# EasyEDA Pro project ProPrj_Compact_LED_Driver_PWM_Single_ATtiny1616_Double_2024-10-07.epro, schematic schematic1
Board Name: Board1; Create Date: 2024-02-08; Project Name: Compact_LED_Driver_PWM_Single_ATtiny1616_Double; Schematic Name: schematic1; Update Date: 2024-02-11
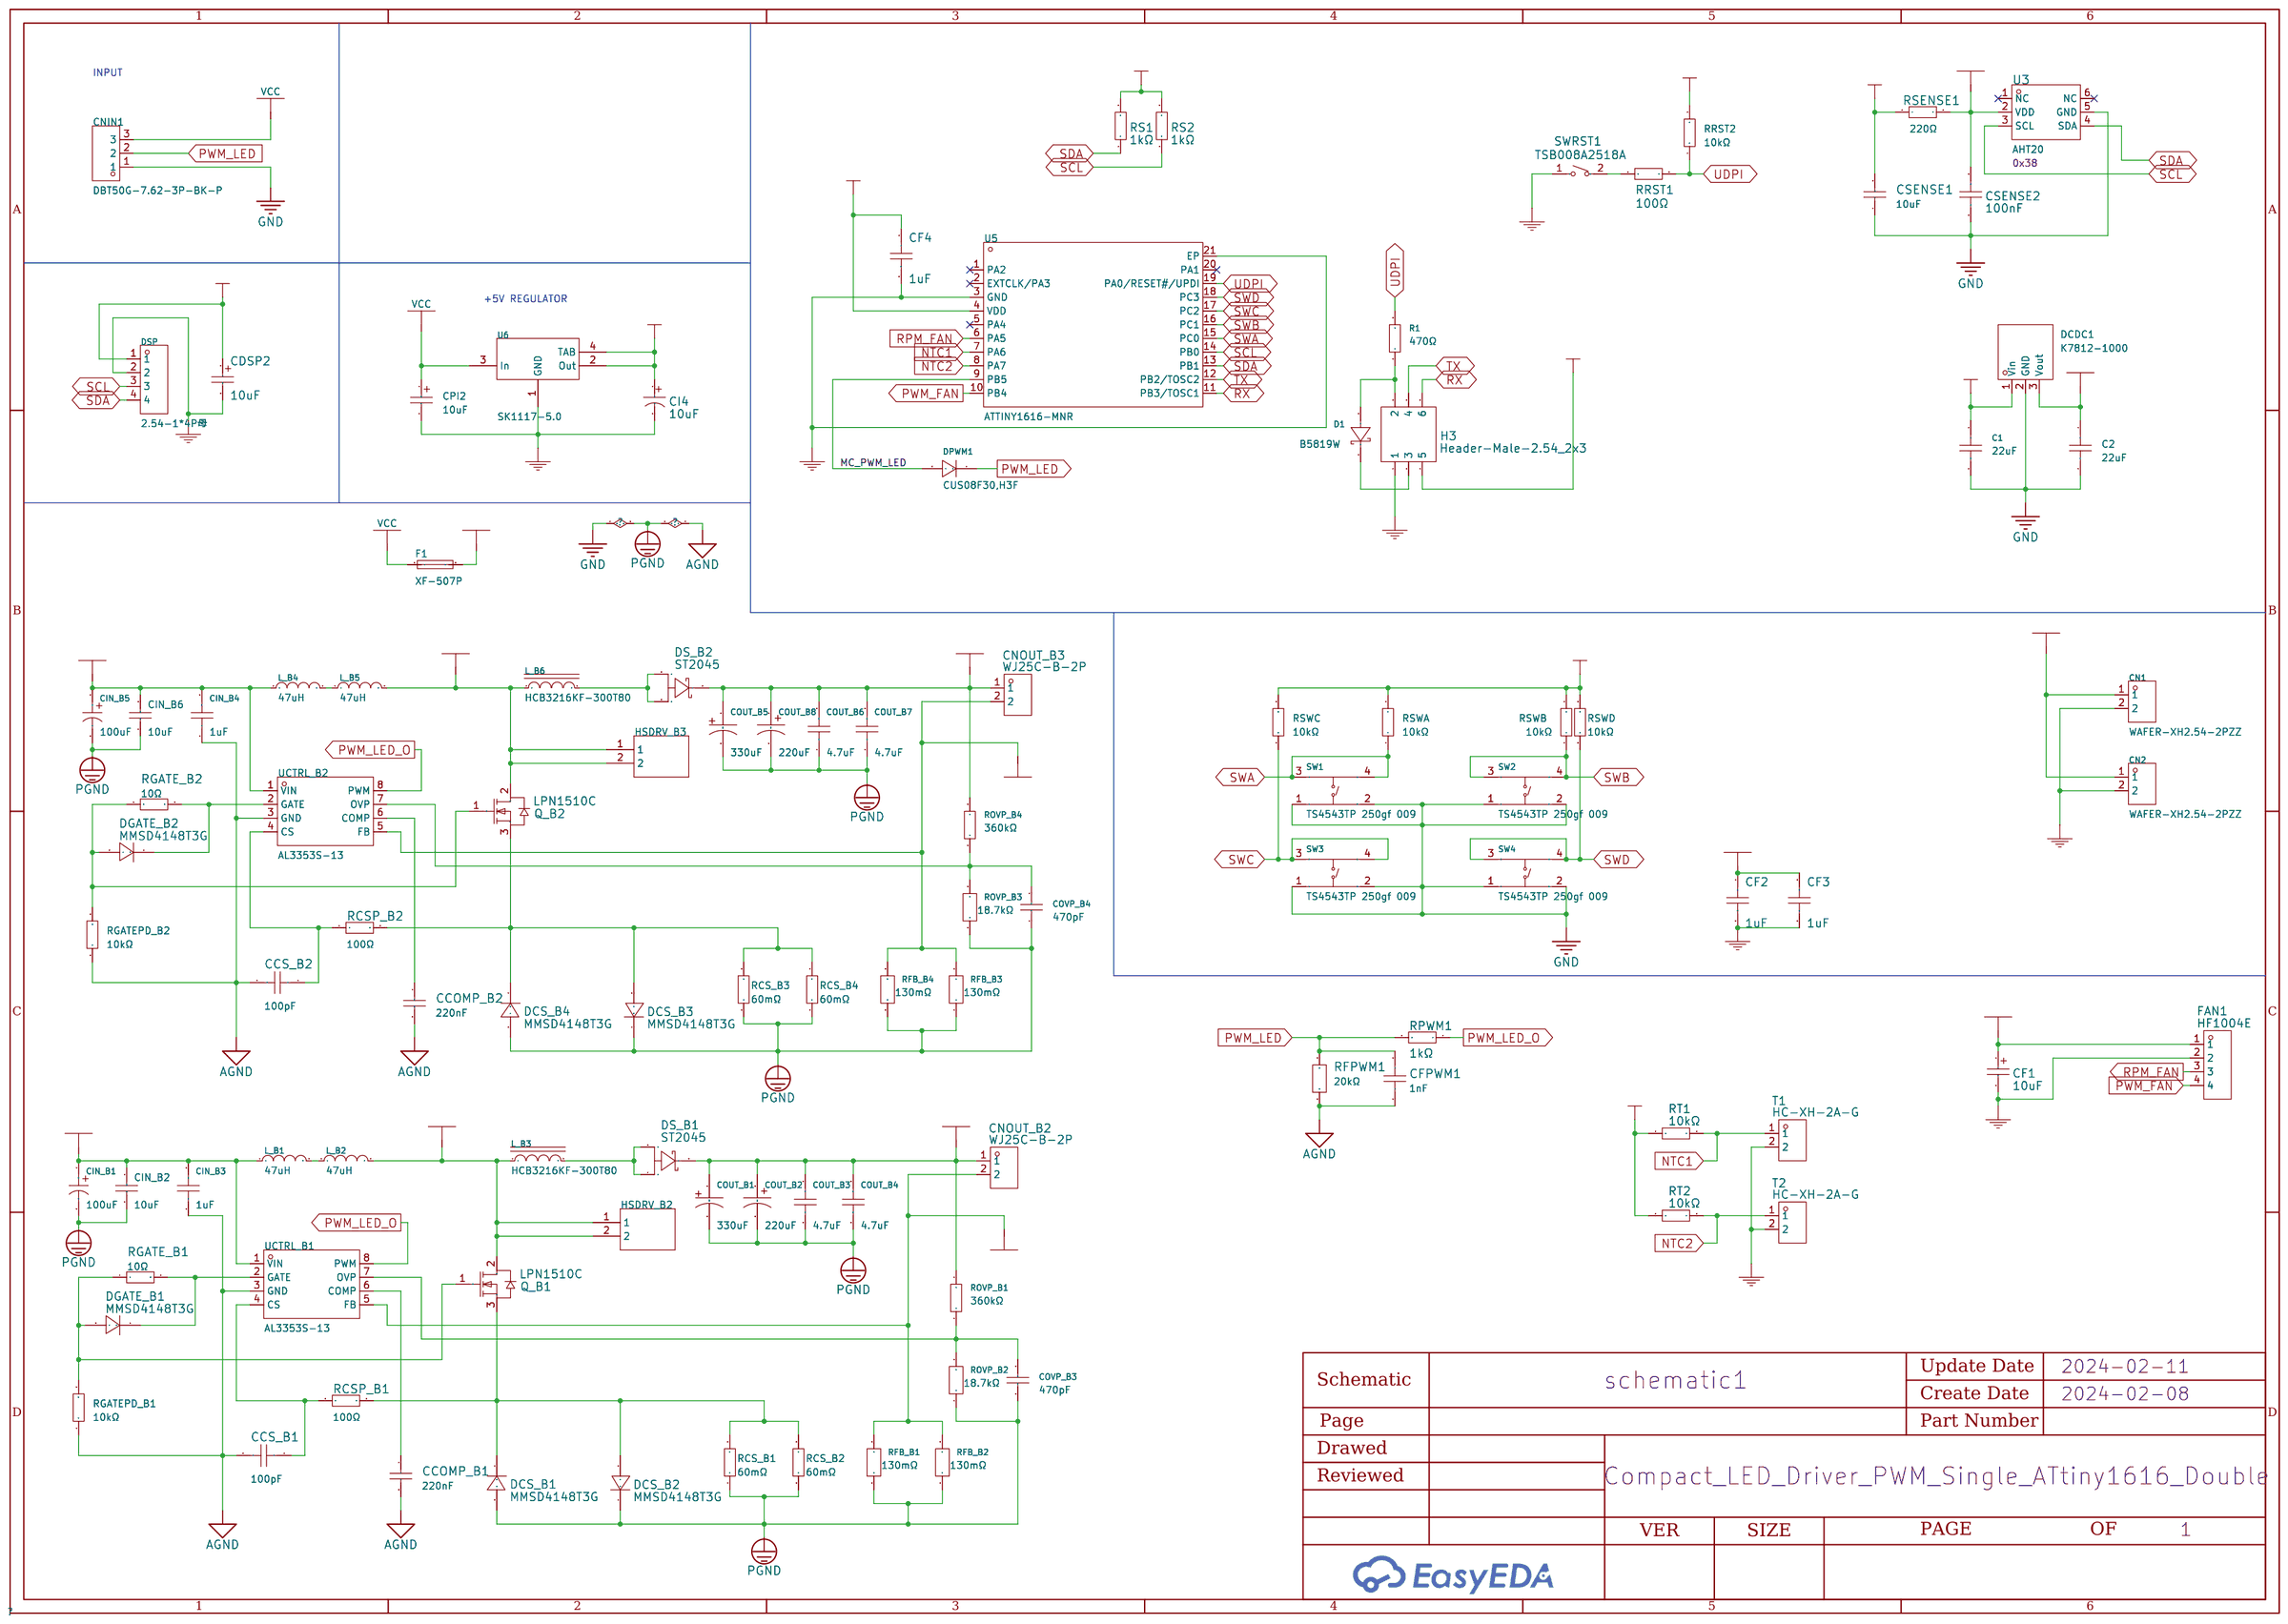
[diagram p0: schematic sheet]

## Parts
C1  22uF  [C0805]
C2  22uF  [C0805]
CCOMP_B1  220nF  [C0402]
CCOMP_B2  220nF  [C0402]
CCS_B1  100pF  [C0402]
CCS_B2  100pF  [C0402]
CDSP2  10uF  [CAP-SMD_L3.2-W1.6-R-RD]
CF1  10uF  [CAP-SMD_L3.5-W2.8]
CF2  1uF  [0402]
CF3  1uF  [0402]
CF4  1uF  [0402]
CFPWM1  1nF  [C0603]
CI4  10uF  [CAP-SMD_L3.2-W1.6]
CIN_B1  100uF  [CAP-TH_BD10.0-P5.00-D0.6-FD-A]
CIN_B2  10uF  [C0805]
CIN_B3  1uF  [C0402]
CIN_B4  1uF  [C0402]
CIN_B5  100uF  [CAP-TH_BD10.0-P5.00-D0.6-FD-A]
CIN_B6  10uF  [C0805]
CN1  WAFER-XH2.54-2PZZ  [CONN-TH_XH2.54-2P]
CN2  WAFER-XH2.54-2PZZ  [CONN-TH_XH2.54-2P]
CNIN1  DBT50G-7.62-3P-BK-P  [CONN-TH_3P-P7.62_L15.2-W24.4-EX4.2]
CNOUT_B2  WJ25C-B-2P  [CONN-TH_2P-P7.62_WJ25C-B-7.62-2P]
CNOUT_B3  WJ25C-B-2P  [CONN-TH_2P-P7.62_WJ25C-B-7.62-2P]
COUT_B1  330uF  [CAP-TH_BD10.0-P5.00-D1.0-FD]
COUT_B2  220uF  [CAP-TH_BD10.0-P5.00-D0.6-FD-A]
COUT_B3  4.7uF  [C1210]
COUT_B4  4.7uF  [C1210]
COUT_B5  330uF  [CAP-TH_BD10.0-P5.00-D1.0-FD]
COUT_B6  4.7uF  [C1210]
COUT_B7  4.7uF  [C1210]
COUT_B8  220uF  [CAP-TH_BD10.0-P5.00-D0.6-FD-A]
COVP_B3  470pF  [C0402]
COVP_B4  470pF  [C0402]
CPI2  10uF  [CASE-C_6032]
CSENSE1  10uF  [C0402]
CSENSE2  100nF  [C0402]
D1  B5819W  [SOD-123F_L2.7-W1.6-LS3.8-RD-1]
DCDC1  K7812-1000  [PWRM-TH_K78XX-1000]
DCS_B1  MMSD4148T3G  [SOD-123FL_L2.6-W1.6-LS3.4-RD]
DCS_B2  MMSD4148T3G  [SOD-123FL_L2.6-W1.6-LS3.4-RD]
DCS_B3  MMSD4148T3G  [SOD-123FL_L2.6-W1.6-LS3.4-RD]
DCS_B4  MMSD4148T3G  [SOD-123FL_L2.6-W1.6-LS3.4-RD]
DGATE_B1  MMSD4148T3G  [SOD-123FL_L2.6-W1.6-LS3.4-RD]
DGATE_B2  MMSD4148T3G  [SOD-123FL_L2.6-W1.6-LS3.4-RD]
DPWM1  CUS08F30,H3F  [SOD-323F_L2.0-W1.6-LS2.5-RD]
DS_B1  ST2045  [TO-277_3P-L5.4-W4.0-LS6.5-BR]
DS_B2  ST2045  [TO-277_3P-L5.4-W4.0-LS6.5-BR]
DSP  2.54-1*4P母  [HDR-TH_4P-P2.54-V-F]
F1  XF-507P  [CONN-TH_XF-507P]
FAN1  HF1004E  [CONN-TH_4P-P2.54_HF1004E]
H3  Header-Male-2.54_2x3  [HDR-TH_6P-P2.54-V-M-R2-C3-S2.54-1]
HSDRV_B2  -  [xsd366094]
HSDRV_B3  -  [xsd366094]
L_B1  47uH  [IND-TH_L17.8-W17.8-P13.00-D0.6]
L_B2  47uH  [IND-TH_L17.8-W17.8-P13.00-D0.6]
L_B3  HCB3216KF-300T80  [L1206]
L_B4  47uH  [IND-TH_L17.8-W17.8-P13.00-D0.6]
L_B5  47uH  [IND-TH_L17.8-W17.8-P13.00-D0.6]
L_B6  HCB3216KF-300T80  [L1206]
Q_B1  LPN1510C  [TO-220-3_L10.0-W4.5-P2.54-L]
Q_B2  LPN1510C  [TO-220-3_L10.0-W4.5-P2.54-L]
R1  470Ω  [R0402]
RCS_B1  60mΩ  [R2512]
RCS_B2  60mΩ  [R2512]
RCS_B3  60mΩ  [R2512]
RCS_B4  60mΩ  [R2512]
RCSP_B1  100Ω  [R0402]
RCSP_B2  100Ω  [R0402]
RFB_B1  130mΩ  [RES-SMD_L6.4-W3.2-R2512]
RFB_B2  130mΩ  [RES-SMD_L6.4-W3.2-R2512]
RFB_B3  130mΩ  [RES-SMD_L6.4-W3.2-R2512]
RFB_B4  130mΩ  [RES-SMD_L6.4-W3.2-R2512]
RFPWM1  20kΩ  [R0402]
RGATE_B1  10Ω  [R0402]
RGATE_B2  10Ω  [R0402]
RGATEPD_B1  10kΩ  [R0402]
RGATEPD_B2  10kΩ  [R0402]
ROVP_B1  360kΩ  [R0402]
ROVP_B2  18.7kΩ  [R0402]
ROVP_B3  18.7kΩ  [R0402]
ROVP_B4  360kΩ  [R0402]
RPWM1  1kΩ  [R0402]
RRST1  100Ω  [R0402]
RRST2  10kΩ  [R0402]
RS1  1kΩ  [R0402]
RS2  1kΩ  [R0402]
RSENSE1  220Ω  [R0402]
RSWA  10kΩ  [R0402]
RSWB  10kΩ  [R0402]
RSWC  10kΩ  [R0402]
RSWD  10kΩ  [R0402]
RT1  10kΩ  [R0402]
RT2  10kΩ  [R0402]
SW1  TS4543TP 250gf 009  [SW-SMD_4P-L4.5-W4.5-P3.00-LS6.9]
SW2  TS4543TP 250gf 009  [SW-SMD_4P-L4.5-W4.5-P3.00-LS6.9]
SW3  TS4543TP 250gf 009  [SW-SMD_4P-L4.5-W4.5-P3.00-LS6.9]
SW4  TS4543TP 250gf 009  [SW-SMD_4P-L4.5-W4.5-P3.00-LS6.9]
SWRST1  TSB008A2518A  [SW-SMD_L6.0-W3.5-LS8.2]
T1  HC-XH-2A-G  [CONN-TH_2P-P2.50_HC-XH-2A-G]
T2  HC-XH-2A-G  [CONN-TH_2P-P2.50_HC-XH-2A-G]
U3  AHT20  [SENSOR-SMD_L3.0-W3.0-P1.00-BR]
U5  ATTINY1616-MNR  [QFN-20_L3.0-W3.0-P0.40-BL-EP1.7]
U6  SK1117-5.0  [SOT-223_L6.5-W3.5-P2.30-LS7.0-BR]
UCTRL_B1  AL3353S-13  [SOIC-8_L4.9-W3.9-P1.27-LS6.0-BL]
UCTRL_B2  AL3353S-13  [SOIC-8_L4.9-W3.9-P1.27-LS6.0-BL]

## Library data of the parts
C1 = CGA0805X5R226M350MT: Capacitance:22uF Tolerance:±20% Tolerance:±20% Voltage Rated: Temperature Coefficient:; LCSC Part Name: 22uF ±20% 35V; Supplier Part: C6119901; Manufacturer: HRE(芯声); Supplier Footprint: 0805; JLCPCB Part Class: Extended Part; Datasheet: https://atta.szlcsc.com/upload/public/pdf/source/20231129/D589D0CC4D260F7AC3A77E53B455CCB3.pdf; Supplier: LCSC; Tolerance: ±20%
C2 = CL21A226MAYNNNE: Capacitance: Tolerance:±20% Tolerance:±20% Voltage Rated: Temperature Coefficient:; LCSC Part Name: 22uF ±20% 25V; Supplier Part: C602037; Manufacturer: SAMSUNG(三星); Supplier Footprint: 0805; JLCPCB Part Class: Extended Part; Datasheet: https://atta.szlcsc.com/upload/public/pdf/source/20200609/C602037_1A0D619693E608A1BF6E80154254E2DB.pdf; Supplier: LCSC; Tolerance: ±20%
CCOMP_B1 CCOMP_B2 = CL05A224KA5NNNC: Capacitance: Tolerance:±10% Tolerance:±10% Voltage Rated: Temperature Coefficient:; LCSC Part Name: 220nF ±10% 25V; Supplier Part: C47129; Manufacturer: SAMSUNG(三星); Supplier Footprint: 0402; JLCPCB Part Class: Extended Part; Datasheet: https://atta.szlcsc.com/upload/public/pdf/source/20160218/1457707763339.pdf; Supplier: LCSC; Tolerance: ±10%
CCS_B1 CCS_B2 = TCC0402COG101K500AT: Capacitance: Tolerance:±10% Tolerance:±10% Voltage Rated: Temperature Coefficient:; LCSC Part Name: 100pF ±10% 50V; Supplier Part: C696853; Manufacturer: CCTC(三环); Supplier Footprint: 0402; JLCPCB Part Class: Extended Part; Datasheet: https://atta.szlcsc.com/upload/public/pdf/source/20200707/C696841_89A2C111301AB76AE7642008585E7A11.pdf; Supplier: LCSC; Tolerance: ±10%
CDSP2 = 10uF: Supplier: LCSC; Manufacturer: AVX; Manufacturer Part: TAJA106K010RNJ; Supplier Part: C7177; JLCPCB Part Class: Extend
CF1 = 10uF: Supplier: LCSC; Manufacturer: Xiangyee; Manufacturer Part: CA45-B025K106T; Supplier Part: C119050; JLCPCB Part Class: Extend
CF2-CF4 = 1uF: Supplier: LCSC; Manufacturer: SAMSUNG; Manufacturer Part: CL05A105KA5NQNC; Supplier Part: C52923; JLCPCB Part Class: Basic
CFPWM1 = FN18X102K500PSG: Capacitance: Tolerance:±10% Tolerance:±10% Voltage Rated: Temperature Coefficient:; LCSC Part Name: 1nF ±10% 50V; Supplier Part: C525263; Manufacturer: PSA(信昌电陶); Supplier Footprint: 0603; JLCPCB Part Class: Extended Part; Datasheet: https://atta.szlcsc.com/upload/public/pdf/source/20200506/C436246_4EAA78C9048D88437BAF2CB7B8BE45FD.pdf; Supplier: LCSC; Tolerance: ±10%
CI4 = 10uF: Supplier: LCSC; Manufacturer: Xiangyee; Manufacturer Part: CA45-A016K106T; Supplier Part: C119051; JLCPCB Part Class: Extend
CIN_B1 CIN_B5 = 1010631012R00: Capacitance: Tolerance:±20% Tolerance:±20% Rated Voltage: φD: L: Operating Temperature:-55℃~+105℃ Operating Temperature:-55℃~+105℃; LCSC Part Name: 100uF ±20% 63V; Supplier Part: C2887235; Manufacturer: NJCON(永立); Supplier Footprint: 插件,D10xL12mm; JLCPCB Part Class: Extended Part; Datasheet: https://atta.szlcsc.com/upload/public/pdf/source/20210902/84CE7E45D44660992A8A41ADB32108B0.pdf; Supplier: LCSC; Tolerance: ±20%; Operating Temperature: -55℃~+105℃
CIN_B2 CIN_B6 = CL21A106KAYNNNE_C15850: Capacitance: Tolerance:±10% Tolerance:±10% Voltage Rated: Temperature Coefficient:; LCSC Part Name: 10uF ±10% 25V; Supplier Part: C15850; Manufacturer: SAMSUNG(三星); Manufacturer Part: CL21A106KAYNNNE; Supplier Footprint: 0805; JLCPCB Part Class: Basic Part; Datasheet: https://atta.szlcsc.com/upload/public/pdf/source/20160103/1457707679302.pdf; Supplier: LCSC; Tolerance: ±10%
CIN_B3 CIN_B4 = CL05A105KA5NQNC: Capacitance: Tolerance:±10% Tolerance:±10% Voltage Rated: Temperature Coefficient:; LCSC Part Name: 1uF ±10% 25V; Supplier Part: C52923; Manufacturer: SAMSUNG(三星); Supplier Footprint: 0402; JLCPCB Part Class: Basic Part; Datasheet: https://atta.szlcsc.com/upload/public/pdf/source/20160218/1457707763339.pdf; Supplier: LCSC; Tolerance: ±10%
CN1 CN2 = WAFER-XH2.54-2PZZ: Pins Structure:1x2P Pitch:2.54mm Mounting Style:Straight Number of Pins:2P Number of Rows:1 Number of PINs Per Row:2 Current Rating (Max):2A Operating Temperature Range:-25℃~+85℃ Operating Temperature Range:-25℃~+85℃; LCSC Part Name: XH 2.54mm 1x2P 直插; Supplier Part: C5359631; Manufacturer: XUNPU(讯普); Supplier Footprint: 插件,P=2.54mm; JLCPCB Part Class: Extended Part; Datasheet: https://atta.szlcsc.com/upload/public/pdf/source/20230221/5D6483F9C7001DB87CFCFC787E1DC139.pdf; Supplier: LCSC; Pins Structure: 1x2P; Pitch: 2.54mm; Mounting Style: Straight; Number of Pins: 2P; Number of Rows: 1; Number of PINs Per Row: 2; Current Rating (Max): 2A; Operating Temperature Range: -25℃~+85℃
CNIN1 = DBT50G-7.62-3P-BK-P: Barrier Type:带盖板 Pitch:7.62mm Number of PINs Per Row:3 Number of Rows:1 Mounting Style:直针 Pin Location:边脚 Current Rating (Max):20A Voltage Rating (Max):300V Wire Gauge - AWG:12~22 Wire Gauge - mm?:- Operating Temperature Range:-40℃~+105℃ Operating Tempera; LCSC Part Name: 7.62mm 每排P数:3 排数:1 直针 边脚; Supplier Part: C496128; Manufacturer: DIBO(地博电气); Supplier Footprint: 直插,P=7.62mm; JLCPCB Part Class: Extended Part; Datasheet: https://atta.szlcsc.com/upload/public/pdf/source/20200325/C496127_C06BD9E7CF9E9F2FA4FD569ADCB4ABF1.pdf; Supplier: LCSC; Barrier Type: 带盖板; Pitch: 7.62mm; Number of PINs Per Row: 3; Number of Rows: 1; Mounting Style: 直针; Pin Location: 边脚; Current Rating (Max): 20A; Voltage Rating (Max): 300V; Wire Gauge - AWG: 12~22; Operating Temperature Range: -40℃~+105℃; Color: Black
CNOUT_B2 CNOUT_B3 = WJ25C-B-2P: Supplier: LCSC; Manufacturer: KANGNEX(康奈克斯电气); Manufacturer Part: WJ25C-B-7.62-2P; Supplier Part: C8422; JLCPCB Part Class: Extended Part; link: https://lcsc.com/eda_search?q=C8422&amp;%26type=1&amp;ref=editor
COUT_B1 COUT_B5 = RG063M331LO10*20TA-1A1E: Capacitance: Tolerance:±20% Tolerance:±20% Rated Voltage: Lead Spacing: φD: L: Lifetime @ Temp:7000hrs@105℃; LCSC Part Name: 330uF ±20% 63V; Supplier Part: C357629; Manufacturer: BERYL(绿宝石); Supplier Footprint: 插件,D10xL20mm; JLCPCB Part Class: Extended Part; Datasheet: https://atta.szlcsc.com/upload/public/pdf/source/20190116/C365798_BC4DCA200151769C852491AB8CDBB435.pdf; Supplier: LCSC; Tolerance: ±20%; Lifetime @ Temp: 7000hrs@105℃
COUT_B2 COUT_B8 = SPZ1JM221G15O00RAXXX: Capacitance: Tolerance:±20% Tolerance:±20% Rated Voltage: Ripple Current:2.65A@100kHz Equivalent Series Resistance(ESR):20mΩ@100kHz Type:Polymer Lead Spacing: φD: L: Lifetime @ Temp:2000hrs@105℃ Operating Temperature:-55℃~+105℃ Operating Temperature:-55℃~; LCSC Part Name: 220uF ±20% 63V; Supplier Part: C2983797; Manufacturer: AISHI(艾华集团); Supplier Footprint: 插件,D10xL15mm; JLCPCB Part Class: Extended Part; Datasheet: https://atta.szlcsc.com/upload/public/pdf/source/20180906/C160181_A9A2ACDA3CC278FCDBAF747E681A6DA5.pdf; Supplier: LCSC; Tolerance: ±20%; Ripple Current: 2.65A@100kHz; Equivalent Series Resistance(ESR): 20mΩ@100kHz; Type: Polymer; Lifetime @ Temp: 2000hrs@105℃; Operating Temperature: -55℃~+105℃
COUT_B3 COUT_B4 COUT_B6 COUT_B7 = FS32X475K101EGG: Capacitance: Tolerance:±10% Tolerance:±10% Voltage Rated: Temperature Coefficient:; LCSC Part Name: 4.7uF ±10% 100V; Supplier Part: C381466; Manufacturer: PSA(信昌电陶); Supplier Footprint: 1210; JLCPCB Part Class: Extended Part; Datasheet: https://atta.szlcsc.com/upload/public/pdf/source/20190723/C381466_B1CCDB289216E7EE775C98769E222CFD.pdf; Supplier: LCSC; Tolerance: ±10%
COVP_B3 COVP_B4 = 0402B471K500NT: Capacitance: Tolerance:±10% Tolerance:±10% Voltage Rated: Temperature Coefficient:; LCSC Part Name: 470pF ±10% 50V; Supplier Part: C1537; Manufacturer: FH(风华); Supplier Footprint: 0402; JLCPCB Part Class: Basic Part; Datasheet: https://atta.szlcsc.com/upload/public/pdf/source/20200305/C486355_26A10D38EF8C2A5C37091D0039909270.pdf; Supplier: LCSC; Tolerance: ±10%
CPI2 = TAJC106K035RNJ: Capacitance: Tolerance:±10% Tolerance:±10% Rated Voltage: Equivalent Series Resistance(ESR):1.6Ω@100kHz Operating Temperature:-55℃~+125℃ Operating Temperature:-55℃~+125℃; LCSC Part Name: 10uF ±10% 35V; Supplier Part: C7211; Manufacturer: Kyocera AVX; Supplier Footprint: CASE-C-6032; JLCPCB Part Class: Extended Part; Datasheet: https://atta.szlcsc.com/upload/public/pdf/source/20160107/1457707750344.pdf; Supplier: LCSC; Tolerance: ±10%; Equivalent Series Resistance(ESR): 1.6Ω@100kHz; Operating Temperature: -55℃~+125℃
CSENSE1 = CL05A106MQ5NUNC: Capacitance: Tolerance:±20% Tolerance:±20% Voltage Rated: Temperature Coefficient:; LCSC Part Name: 10uF ±20% 6.3V; Supplier Part: C15525; Manufacturer: SAMSUNG(三星); Supplier Footprint: 0402; JLCPCB Part Class: Basic Part; Datasheet: https://atta.szlcsc.com/upload/public/pdf/source/20220823/2B02EE04F8F211D38A52DCB16EB6BEBA.pdf; Supplier: LCSC; Tolerance: ±20%
CSENSE2 = 100nF: Supplier: LCSC; Supplier Part: C392963; Manufacturer: CCTC(三环); Manufacturer Part: TCC0402X7R104K160AT; JLCPCB Part Class: Extended Part; link: https://lcsc.com/eda_search?q=C392963&amp;%26type=1&amp;ref=editor
D1 = B5819W_C2943878: Diode Configuration:- Forward Voltage (Vf@If):580mV@1A Reverse Voltage (Vr):40V Average Rectified Current (Io):1A Reverse Leakage Current (Ir):50uA@40V; LCSC Part Name: 电压:40V 电流:1A; Supplier Part: C2943878; Manufacturer: GOODWORK(固得沃克); Supplier Footprint: SOD-123; JLCPCB Part Class: Extended Part; Datasheet: https://atta.szlcsc.com/upload/public/pdf/source/20220114/81042131F39C8520B6390246D7392C1A.pdf; Supplier: LCSC; Forward Voltage (Vf@If): 580mV@1A; Reverse Voltage (Vr): 40V; Average Rectified Current (Io): 1A; Reverse Leakage Current (Ir): 50uA@40V
DCDC1 = K7812-1000_C5199013: Conversion Type:DC-DC Input Voltage(DC):16V~30V Input Voltage(DC):16V~30V Output Voltage:12V；-12V Output Voltage:12V；-12V Output Power:12W Output Current (Max):1A Output Current (Max):1A Function:降压型 Conversion Efficiency:93% Conversion Efficiency:93% Max; Supplier Part: C5199013; Manufacturer: JETEKPS(健特); Supplier Footprint: SIP-3; JLCPCB Part Class: Extended Part; Datasheet: https://atta.szlcsc.com/upload/public/pdf/source/20221014/D9FCF1D4FFB50CA154AEC6EC404A5A87.pdf; Supplier: LCSC; Conversion Type: DC-DC; Input Voltage(DC): 16V~30V; Output Voltage: 12V；-12V; Output Power: 12W; Output Current (Max): 1A; Function: 降压型; Conversion Efficiency: 93%; Maximum Capacitive Load: 680uF
DCS_B1-DCS_B4 DGATE_B1 DGATE_B2 = MMSD4148T3G: Supplier: LCSC; Supplier Part: C232560; Manufacturer: ONSemicon
DPWM1 = CUS08F30,H3F: Forward Voltage (Vf@If):220mV@10mA Reverse Voltage (Vr):30V Average Rectified Current (Io):800mA Reverse Leakage Current (Ir):50uA@30V; LCSC Part Name: 电压:30V 电流:800mA; Supplier Part: C150183; Manufacturer: TOSHIBA(东芝); Supplier Footprint: SC-76(SOD-323); JLCPCB Part Class: Extended Part; Datasheet: https://atta.szlcsc.com/upload/public/pdf/source/20180126/C150183_15169561730551309331.pdf; Supplier: LCSC; Forward Voltage (Vf@If): 220mV@10mA; Reverse Voltage (Vr): 30V; Average Rectified Current (Io): 800mA; Reverse Leakage Current (Ir): 50uA@30V
DS_B1 DS_B2 = ST2045: Supplier: LCSC; Supplier Part: C840773; Manufacturer: MDD（MicrodiodeElectronics）; JLCPCB Part Class: ExtendedPart
DSP = 2.54-1*4P母: Number of Rows:Plugin Number of Holes:4P Pitch:2.54mm Holes Structure:1x4P Row Spacing:- Mounting Type:Straight Circular Hole / Square Hole:Square Holes Current Rating (Max):3A Voltage Rating (Max):- Holes Direction:Top Insulation Height:- Contact Materia; LCSC Part Name: 间距:2.54mm 1x4P 直插; Supplier Part: C2718488; Manufacturer: BOOMELE(博穆精密); Supplier Footprint: 插件,P=2.54mm; JLCPCB Part Class: Extended Part; Datasheet: https://atta.szlcsc.com/upload/public/pdf/source/20210301/C2718488_F4427B881E42CAA8DDB0B1C12B3A522C.pdf; Supplier: LCSC; Number of Rows: Plugin; Number of Holes: 4P; Pitch: 2.54mm; Holes Structure: 1x4P; Mounting Type: Straight; Circular Hole / Square Hole: Square Holes; Current Rating (Max): 3A; Holes Direction: Top; Contact Material: bronze; Operating Temperature Range: -40℃~+105℃
F1 = XF-507P: Fuseholder Type:- Fuse Type:- Fuse Size:-; LCSC Part Name: 中号汽车保险丝夹 2P; Supplier Part: C668119; Manufacturer: XFCN(兴飞); JLCPCB Part Class: Extended Part; Datasheet: https://atta.szlcsc.com/upload/public/pdf/source/20210825/7557D7920E5607B38A356D661AFA8BB4.pdf; Supplier: LCSC
FAN1 = HF1004E: JLCPCB Part Class: Extended Part; Supplier: LCSC; Supplier Part: C2761402; Manufacturer: FOXCONN(富士康); link: https://lcsc.com/eda_search?q=C2761402&amp;%26type=1&amp;ref=editor
H3 = Header-Male-2.54_2x3: Supplier: LCSC; Manufacturer: BOOMELE; Supplier Part: C65114
HSDRV_B2 HSDRV_B3 = XSD366-094: Supplier: LCSC; Part Number: C286227; Manufacturer: XSD
L_B1 L_B2 L_B4 L_B5 = PDPMAA1712-470MP: Inductance: Tolerance:±20% Tolerance:±20% Rated Current: Type:- DC Resistance (DCR): Saturation Current (Isat):14A Ratings:AEC-Q200; LCSC Part Name: 47uH ±20% 14A; Supplier Part: C5119635; Manufacturer: PROD(谱罗德); Supplier Footprint: 插件,12x17mm; JLCPCB Part Class: Extended Part; Datasheet: https://atta.szlcsc.com/upload/public/pdf/source/20220726/50FFBD826C58D9A93824C56B87EB4C0A.pdf; Supplier: LCSC; Tolerance: ±20%; Saturation Current (Isat): 14A; Ratings: AEC-Q200
L_B3 L_B6 = HCB3216KF-300T80: Impedance @ Frequency:30Ω@100MHz Tolerance:±25% Tolerance:±25% DC Resistance:10mΩ Current Rating:8A Circuits:1; LCSC Part Name: 单路 1206磁珠 阻抗30Ω@100MHz; Supplier Part: C525677; Manufacturer: TAI-TECH(台庆); Supplier Footprint: 1206; JLCPCB Part Class: Extended Part; Datasheet: https://atta.szlcsc.com/upload/public/pdf/source/20200917/C525677_42F8EB0AB6D29C2FF51D5284BD20B06E.pdf; Supplier: LCSC; Impedance @ Frequency: 30Ω@100MHz; Tolerance: ±25%; DC Resistance: 10mΩ; Current Rating: 8A; Circuits: 1
Q_B1 Q_B2 = LPN1510C: Supplier: LCSC; Supplier Part: C2650; Manufacturer: Infineon Technologies; Manufacturer Part: IRFB4110PBF
R1 = 0402WGJ0471TCE: Type:Thick Film Resistors Resistance: Tolerance:±5% Tolerance:±5% Power(Watts): Overload Voltage (Max): Temperature Coefficient:±100ppm/℃ Temperature Coefficient:±100ppm/℃ Operating Temperature Range:-55℃~+155℃ Operating Temperature Range:-55℃~+155℃; LCSC Part Name: 470Ω ±5% 62.5mW 厚膜电阻; Supplier Part: C25167; Manufacturer: UNI-ROYAL(厚声); Supplier Footprint: 0402; JLCPCB Part Class: Extended Part; Datasheet: https://atta.szlcsc.com/upload/public/pdf/source/20200306/C422600_1E6D84923E4A46A82E41ADD87F860B5C.pdf; Supplier: LCSC; Type: Thick Film Resistors; Tolerance: ±5%; Temperature Coefficient: ±100ppm/℃; Operating Temperature Range: -55℃~+155℃
RCS_B1-RCS_B4 = MA251230FR060FZ: Type:Current Sensing Resistors Resistance: Tolerance:±1% Tolerance:±1% Power(Watts): Temperature Coefficient:±50ppm/℃ Temperature Coefficient:±50ppm/℃; LCSC Part Name: 60mΩ ±1% 3W; Supplier Part: C252688; Manufacturer: EVER OHMS(天二科技); Supplier Footprint: 2512; JLCPCB Part Class: Extended Part; Datasheet: https://atta.szlcsc.com/upload/public/pdf/source/20190918/C429585_593C6AC82160B2622F9DF04234CCF0BF.pdf; Supplier: LCSC; Type: Current Sensing Resistors; Tolerance: ±1%; Temperature Coefficient: ±50ppm/℃
RCSP_B1 RCSP_B2 = 0402WGJ0101TCE: Resistance: Tolerance:±5% Tolerance:±5% Power(Watts): Overload Voltage (Max): Temperature Coefficient:±100ppm/℃ Temperature Coefficient:±100ppm/℃ Type:Thick Film Resistors Operating Temperature Range:-55℃~+155℃ Operating Temperature Range:-55℃~+155℃; LCSC Part Name: 100Ω ±5% 62.5mW 厚膜电阻; Supplier Part: C25138; Manufacturer: UNI-ROYAL(厚声); Supplier Footprint: 0402; JLCPCB Part Class: Extended Part; Datasheet: https://atta.szlcsc.com/upload/public/pdf/source/20200306/C422600_1E6D84923E4A46A82E41ADD87F860B5C.pdf; Supplier: LCSC; Tolerance: ±5%; Temperature Coefficient: ±100ppm/℃; Type: Thick Film Resistors; Operating Temperature Range: -55℃~+155℃
RFB_B1-RFB_B4 = HoLR2512-130mR-1%: Type:Current Sensing Resistors Resistance:130mΩ Tolerance:±1% Tolerance:±1% Power(Watts): Temperature Coefficient:±50ppm/℃ Temperature Coefficient:±50ppm/℃ Mounting Sytle:Surface Mount; LCSC Part Name: 130mΩ ±1% 3W; Supplier Part: C5123648; Manufacturer: Milliohm(毫欧); Supplier Footprint: 2512; JLCPCB Part Class: Extended Part; Datasheet: https://atta.szlcsc.com/upload/public/pdf/source/20220816/DFF51DBFD867759FC80BF0AD0C4F973A.pdf; Supplier: LCSC; Type: Current Sensing Resistors; Tolerance: ±1%; Temperature Coefficient: ±50ppm/℃; Mounting Sytle: Surface Mount
RFPWM1 = SCR0402J20K: Resistance: Tolerance:±5% Tolerance:±5%; LCSC Part Name: 20kΩ ±5%; Supplier Part: C3017501; Manufacturer: VO(翔胜); Supplier Footprint: 0402; JLCPCB Part Class: Extended Part; Datasheet: https://atta.szlcsc.com/upload/public/pdf/source/20220513/247AF9639BA21CF93567DC289CCC6A22.pdf; Supplier: LCSC; Tolerance: ±5%
RGATE_B1 RGATE_B2 = 0402WGJ0100TCE: Resistance: Tolerance:±5% Tolerance:±5% Power(Watts): Overload Voltage (Max): Temperature Coefficient:±400ppm/℃ Temperature Coefficient:±400ppm/℃ Type:Thick Film Resistors Operating Temperature Range:-55℃~+155℃ Operating Temperature Range:-55℃~+155℃; LCSC Part Name: 10Ω ±5% 62.5mW 厚膜电阻; Supplier Part: C25139; Manufacturer: UNI-ROYAL(厚声); Supplier Footprint: 0402; JLCPCB Part Class: Extended Part; Datasheet: https://atta.szlcsc.com/upload/public/pdf/source/20200306/C422600_1E6D84923E4A46A82E41ADD87F860B5C.pdf; Supplier: LCSC; Tolerance: ±5%; Temperature Coefficient: ±400ppm/℃; Type: Thick Film Resistors; Operating Temperature Range: -55℃~+155℃
RGATEPD_B1 RGATEPD_B2 RRST2 RSWA RSWB RSWC RSWD = RTT021002FTH: Type:Thick Film Resistors Resistance: Tolerance:±1% Tolerance:±1% Power(Watts): Temperature Coefficient:±100ppm/℃ Temperature Coefficient:±100ppm/℃ Overload Voltage (Max): Operating Temperature Range:-55℃~+155℃ Operating Temperature Range:-55℃~+155℃; LCSC Part Name: 10kΩ ±1% 62.5mW; Supplier Part: C102749; Manufacturer: RALEC(旺诠); Supplier Footprint: 0402; JLCPCB Part Class: Extended Part; Datasheet: https://atta.szlcsc.com/upload/public/pdf/source/20170408/1491642593210.pdf; Supplier: LCSC; Type: Thick Film Resistors; Tolerance: ±1%; Temperature Coefficient: ±100ppm/℃; Operating Temperature Range: -55℃~+155℃
ROVP_B1 ROVP_B4 = 0402WGF3303TCE: Resistance:330000Ω Tolerance:±1% Tolerance:±1% Power(Watts): Overload Voltage (Max): Temperature Coefficient:±100ppm/℃ Temperature Coefficient:±100ppm/℃ Type:Thick Film Resistors Operating Temperature Range:-55℃~+155℃ Operating Temperature Range:-55℃~+155; LCSC Part Name: 330kΩ ±1% 62.5mW 厚膜电阻; Supplier Part: C25778; Manufacturer: UNI-ROYAL(厚声); Manufacturer Part: 0402WGF3603TCE; Supplier Footprint: 0402; JLCPCB Part Class: Extended Part; Datasheet: https://atta.szlcsc.com/upload/public/pdf/source/20200306/C422600_1E6D84923E4A46A82E41ADD87F860B5C.pdf; Supplier: LCSC; Tolerance: ±1%; Temperature Coefficient: ±100ppm/℃; Type: Thick Film Resistors; Operating Temperature Range: -55℃~+155℃
ROVP_B2 ROVP_B3 = SCR0402J13K: Resistance: Tolerance:±5% Tolerance:±5%; LCSC Part Name: 13kΩ ±5%; Supplier Part: C3017587; Manufacturer: UNI-ROYAL(Uniroyal Elec); Manufacturer Part: 0402WGF1872TCE; Supplier Footprint: 0402; JLCPCB Part Class: Extended Part; Datasheet: https://atta.szlcsc.com/upload/public/pdf/source/20220513/247AF9639BA21CF93567DC289CCC6A22.pdf; Supplier: LCSC; Tolerance: ±5%
RPWM1 RS1 RS2 = 1kΩ: Supplier: LCSC; Manufacturer: UNI-ROYAL(厚声); Manufacturer Part: 0402WGJ0102TCE; Supplier Part: C25543; JLCPCB Part Class: Extended Part; link: https://lcsc.com/eda_search?q=C25543&amp;%26type=1&amp;ref=editor
RRST1 = 100Ω: Supplier: LCSC; Manufacturer: UNI-ROYAL(厚声); Manufacturer Part: 0402WGJ0101TCE; Supplier Part: C25138; JLCPCB Part Class: Extended Part; link: https://lcsc.com/eda_search?q=C25138&amp;%26type=1&amp;ref=editor
RSENSE1 = 0402WGJ0221TCE: Resistance: Tolerance:±5% Tolerance:±5% Power(Watts): Overload Voltage (Max): Temperature Coefficient:±100ppm/℃ Temperature Coefficient:±100ppm/℃ Type:Thick Film Resistors Operating Temperature Range:-55℃~+155℃ Operating Temperature Range:-55℃~+155℃; LCSC Part Name: 220Ω ±5% 62.5mW 厚膜电阻; Supplier Part: C25151; Manufacturer: UNI-ROYAL(厚声); Supplier Footprint: 0402; JLCPCB Part Class: Extended Part; Datasheet: https://atta.szlcsc.com/upload/public/pdf/source/20200306/C422600_1E6D84923E4A46A82E41ADD87F860B5C.pdf; Supplier: LCSC; Tolerance: ±5%; Temperature Coefficient: ±100ppm/℃; Type: Thick Film Resistors; Operating Temperature Range: -55℃~+155℃
RT1 RT2 = 10kΩ: Supplier: LCSC; Manufacturer: UNI-ROYAL(厚声); Manufacturer Part: 0402WGF1002TCE; Supplier Part: C25744; JLCPCB Part Class: Basic Part; link: https://lcsc.com/eda_search?q=C25744&amp;%26type=1&amp;ref=editor
SW1-SW4 = TS4543TP 250gf 009: Circuit:SPST Actuator Style:Round Button Switch Length:4.5mm Switch Width:4.5mm Switch Height:4.3mm Strike Gundam:不带 Contact Current:50mA Voltage Rating (AC):- Voltage Rating (DC):12V Power Rating:- Mounting Style:Brick nogging Insulation Resistance:100MΩ; LCSC Part Name: 4.5*4.5*4.3mm 立贴 轻触开关; Supplier Part: C5342984; Manufacturer: SHOU HAN(首韩); Supplier Footprint: SMD; JLCPCB Part Class: Extended Part; Datasheet: https://atta.szlcsc.com/upload/public/pdf/source/20221229/5C13C68590199B5B3AAC59552907253B.pdf; Supplier: LCSC; Circuit: SPST; Actuator Style: Round Button; Switch Length: 4.5mm; Switch Width: 4.5mm; Switch Height: 4.3mm; Strike Gundam: 不带; Contact Current: 50mA; Voltage Rating (DC): 12V; Mounting Style: Brick nogging; Insulation Resistance: 100MΩ; Actuator/Cap Color: Black; With Lamp: No; Operating Force: 250gf; Mechanical Life: 100000次; Operating Temperature: -25℃~+70℃
SWRST1 = TSB008A2518A: Supplier: LCSC; Supplier Part: C2888455; Manufacturer: BZCN(博众电气); JLCPCB Part Class: Extended Part; link: https://lcsc.com/eda_search?q=C2888455&amp;%26type=1&amp;ref=editor
T1 T2 = HC-XH-2A-G: Supplier: LCSC; Supplier Part: C5341201; Manufacturer: HCTL(华灿天禄); JLCPCB Part Class: Extended Part; link: https://lcsc.com/eda_search?q=C5341201&amp;%26type=1&amp;ref=editor
U3 = AHT20: Supplier Part: C2757850; Manufacturer: 广州奥松; Supplier Footprint: SMD; JLCPCB Part Class: Extended Part; Datasheet: https://atta.szlcsc.com/upload/public/pdf/source/20231023/00557B34ED120268320A4810FF8DED4D.pdf; Supplier: LCSC; I2C Address: 0x38
U5 = ATTINY1616-MNR: CPU Core:AVR Program Storage Size:16KB RAM Size:2KB GPIO Ports Number:18 Operating Voltage Range:1.8V~5.5V Operating Voltage Range:1.8V~5.5V CPU Maximum Speed:20MHz Program Memory Type:FLASH Operating Temperature Range:-40℃~+105℃ Operating Temperature Ran; Supplier Part: C507118; Manufacturer: MICROCHIP(美国微芯); Supplier Footprint: QFN-20-EP(3x3); JLCPCB Part Class: Extended Part; Datasheet: https://atta.szlcsc.com/upload/public/pdf/source/20200402/C507118_C9B3D13493A25E1DA778A35EE1D23665.pdf; Supplier: LCSC; CPU Core: AVR; Program Storage Size: 16KB; RAM Size: 2KB; GPIO Ports Number: 18; Operating Voltage Range: 1.8V~5.5V; CPU Maximum Speed: 20MHz; Program Memory Type: FLASH; Operating Temperature Range: -40℃~+105℃; ADC (Bit): 10bit; DAC (Bit): 8bit; Peripheral/Function: WDT；PWM; Watchdog: 有; Infrared Data Association: 有; Low-Voltage Detect: 有; Internal Oscillator: 有
U6 = SK1117-5.0: Output Type:- Maximum Input Voltage:35V Output Voltage:5V Output Voltage:5V Output Current:1.4A Power Supply Rejection Ratio (PSRR):- Dropout Voltage:1.3V Quiescent Current (Ground Current):5mA Noise:- Feature:- Operating Temperature:-40℃~+85℃ Operating T; Supplier Part: C165483; Manufacturer: SHIKUES(时科); Supplier Footprint: SOT-223; JLCPCB Part Class: Extended Part; Datasheet: https://atta.szlcsc.com/upload/public/pdf/source/20230807/33FEE56554B889EFAE05F1B8BF767D93.pdf; Supplier: LCSC; Maximum Input Voltage: 35V; Output Voltage: 5V; Output Current: 1.4A; Dropout Voltage: 1.3V; Quiescent Current (Ground Current): 5mA; Operating Temperature: -40℃~+85℃; Output Polarity: 正
UCTRL_B1 UCTRL_B2 = AL3353S-13: Supplier Part: C2678811; Manufacturer: DIODES(美台); Supplier Footprint: SOIC-8; JLCPCB Part Class: Extended Part; Datasheet: https://atta.szlcsc.com/upload/public/pdf/source/20221028/A621A5B63CD11889266DF73AE9E90277.pdf; Supplier: LCSC

## Nets
+5V: CDSP2.1 CF4.1 CI4.1 CSENSE1.2 DSP.1 H3.5 RRST2.2 RS1.2 RS2.2 RSENSE1.1 RSWA.2 RSWB.2 RSWC.2 RSWD.2 RT1.1 RT2.1 U5.4(VDD) U6.2(Out) U6.4(TAB)
+12V: C2.1 CF1.1 CF2.1 CF3.1 CN1.1 CN2.1 DCDC1.3(Vout) FAN1.1
AGND: C1.2 C2.2 CCOMP_B1.2 CCOMP_B2.2 CCS_B1.2 CCS_B2.2 CDSP2.2 CF1.2 CF2.2 CF3.2 CF4.2 CFPWM1.1 CI4.2 CIN_B1.2 CIN_B2.2 CIN_B3.1 CIN_B4.1 CIN_B5.2 CIN_B6.2 CN1.2 CN2.2 CNIN1.1 COUT_B1.2 COUT_B2.2 COUT_B3.1 COUT_B4.1 COUT_B5.2 COUT_B6.1 COUT_B7.1 COUT_B8.2 COVP_B3.1 COVP_B4.1 CPI2.2 CSENSE1.1 CSENSE2.1 DCDC1.2(GND) DCS_B1.2(A) DCS_B2.1(C) DCS_B3.1(C) DCS_B4.2(A) DSP.2 FAN1.2 H3.1 RCS_B1.1 RCS_B2.1 RCS_B3.1 RCS_B4.1 RFB_B1.1 RFB_B2.1 RFB_B3.1 RFB_B4.1 RFPWM1.1 RGATEPD_B1.1 RGATEPD_B2.1 ROVP_B2.1 ROVP_B3.1 SW1.1(A) SW1.2(B) SW2.1(A) SW2.2(B) SW3.1(A) SW3.2(B) SW4.1(A) SW4.2(B) SWRST1.1 T1.2 T2.2 U3.5(GND) U5.3(GND) U5.21(EP) U6.1(GND) UCTRL_B1.3(GND) UCTRL_B2.3(GND)
VCC: C1.1 CNIN1.3 CPI2.1 DCDC1.1(Vin) F1.1 F1.2 U6.3(In)
VCCF: CIN_B1.1 CIN_B2.1 CIN_B3.2 CIN_B4.2 CIN_B5.1 CIN_B6.1 F1.3 F1.4 L_B1.1 L_B4.1 UCTRL_B1.1(VIN) UCTRL_B2.1(VIN)
VDD: CSENSE2.2 RSENSE1.2 U3.2(VDD)
MC_PWM_LED: DPWM1.2(A) U5.9(PB5)
NTC1: RT1.2 T1.1 U5.7(PA6)
NTC2: RT2.2 T2.1 U5.8(PA7)
PWM_FAN: FAN1.4 U5.10(PB4)
PWM_LED: CFPWM1.2 CNIN1.2 DPWM1.1(C) RFPWM1.2 RPWM1.2
PWM_LED_O: RPWM1.1 UCTRL_B1.8(PWM) UCTRL_B2.8(PWM)
RPM_FAN: FAN1.3 U5.6(PA5)
RX: H3.6 U5.11(PB3/TOSC1)
SCL: DSP.3 RS2.1 U3.3(SCL) U5.14(PB0)
SDA: DSP.4 RS1.1 U3.4(SDA) U5.13(PB1)
SWA: RSWA.1 SW1.3(C) SW1.4(D) U5.15(PC0)
SWB: RSWB.1 SW2.3(C) SW2.4(D) U5.16(PC1)
SWC: RSWC.1 SW3.3(C) SW3.4(D) U5.17(PC2)
SWD: RSWD.1 SW4.3(C) SW4.4(D) U5.18(PC3)
TX: H3.4 U5.12(PB2/TOSC2)
UDPI: R1.2 RRST1.1 RRST2.1 U5.19(PA0/RESET#/UPDI)
V+LED_B_1: CNOUT_B2.1 COUT_B1.1 COUT_B2.1 COUT_B3.2 COUT_B4.2 DS_B1.2(K) ROVP_B1.2
V+LED_B_2: CNOUT_B3.1 COUT_B5.1 COUT_B6.2 COUT_B7.2 COUT_B8.1 DS_B2.2(K) ROVP_B4.2
V-LED_B_1: CNOUT_B2.2 RFB_B1.2 RFB_B2.2 UCTRL_B1.5(FB)
V-LED_B_2: CNOUT_B3.2 RFB_B3.2 RFB_B4.2 UCTRL_B2.5(FB)
VL_B_1: HSDRV_B2.1 HSDRV_B2.2 L_B2.2 L_B3.1 Q_B1.2(D)
VL_B_2: HSDRV_B3.1 HSDRV_B3.2 L_B5.2 L_B6.1 Q_B2.2(D)
$1N8682: DS_B1.1(A) DS_B1.3(A) L_B3.2
$1N8688: L_B1.2 L_B2.1
$1N8707: CCOMP_B1.1 UCTRL_B1.6(COMP)
$1N8712: DGATE_B1.1(C) RGATE_B1.2 UCTRL_B1.2(GATE)
$1N8739: DCS_B1.1(C) DCS_B2.2(A) Q_B1.3(S) RCS_B1.2 RCS_B2.2 RCSP_B1.2
$1N8772: DGATE_B1.2(A) Q_B1.1(G) RGATE_B1.1 RGATEPD_B1.2
$1N8790: CCS_B1.1 RCSP_B1.1 UCTRL_B1.4(CS)
$1N8797: COVP_B3.2 ROVP_B1.1 ROVP_B2.2 UCTRL_B1.7(OVP)
$1N25369: D1.1(K) H3.3
$1N25378: D1.2(A) H3.2 R1.1
$1N26156: RRST1.2 SWRST1.2
$1N34640: DS_B2.1(A) DS_B2.3(A) L_B6.2
$1N34641: L_B4.2 L_B5.1
$1N34643: CCOMP_B2.1 UCTRL_B2.6(COMP)
$1N34645: DGATE_B2.1(C) RGATE_B2.2 UCTRL_B2.2(GATE)
$1N34649: DGATE_B2.2(A) Q_B2.1(G) RGATE_B2.1 RGATEPD_B2.2
$1N34651: CCS_B2.1 RCSP_B2.1 UCTRL_B2.4(CS)
$1N34652: COVP_B4.2 ROVP_B3.2 ROVP_B4.1 UCTRL_B2.7(OVP)
$1N34653: DCS_B3.2(A) DCS_B4.1(C) Q_B2.3(S) RCS_B3.2 RCS_B4.2 RCSP_B2.2

Not connected (* = marked no-connect by the designer): U3 1(NC)* 6(NC)*; U5 1(PA2)* 2(EXTCLK/PA3)* 5(PA4)* 20(PA1)*

## Notes on the sheet
- INPUT
- +5V REGULATOR
